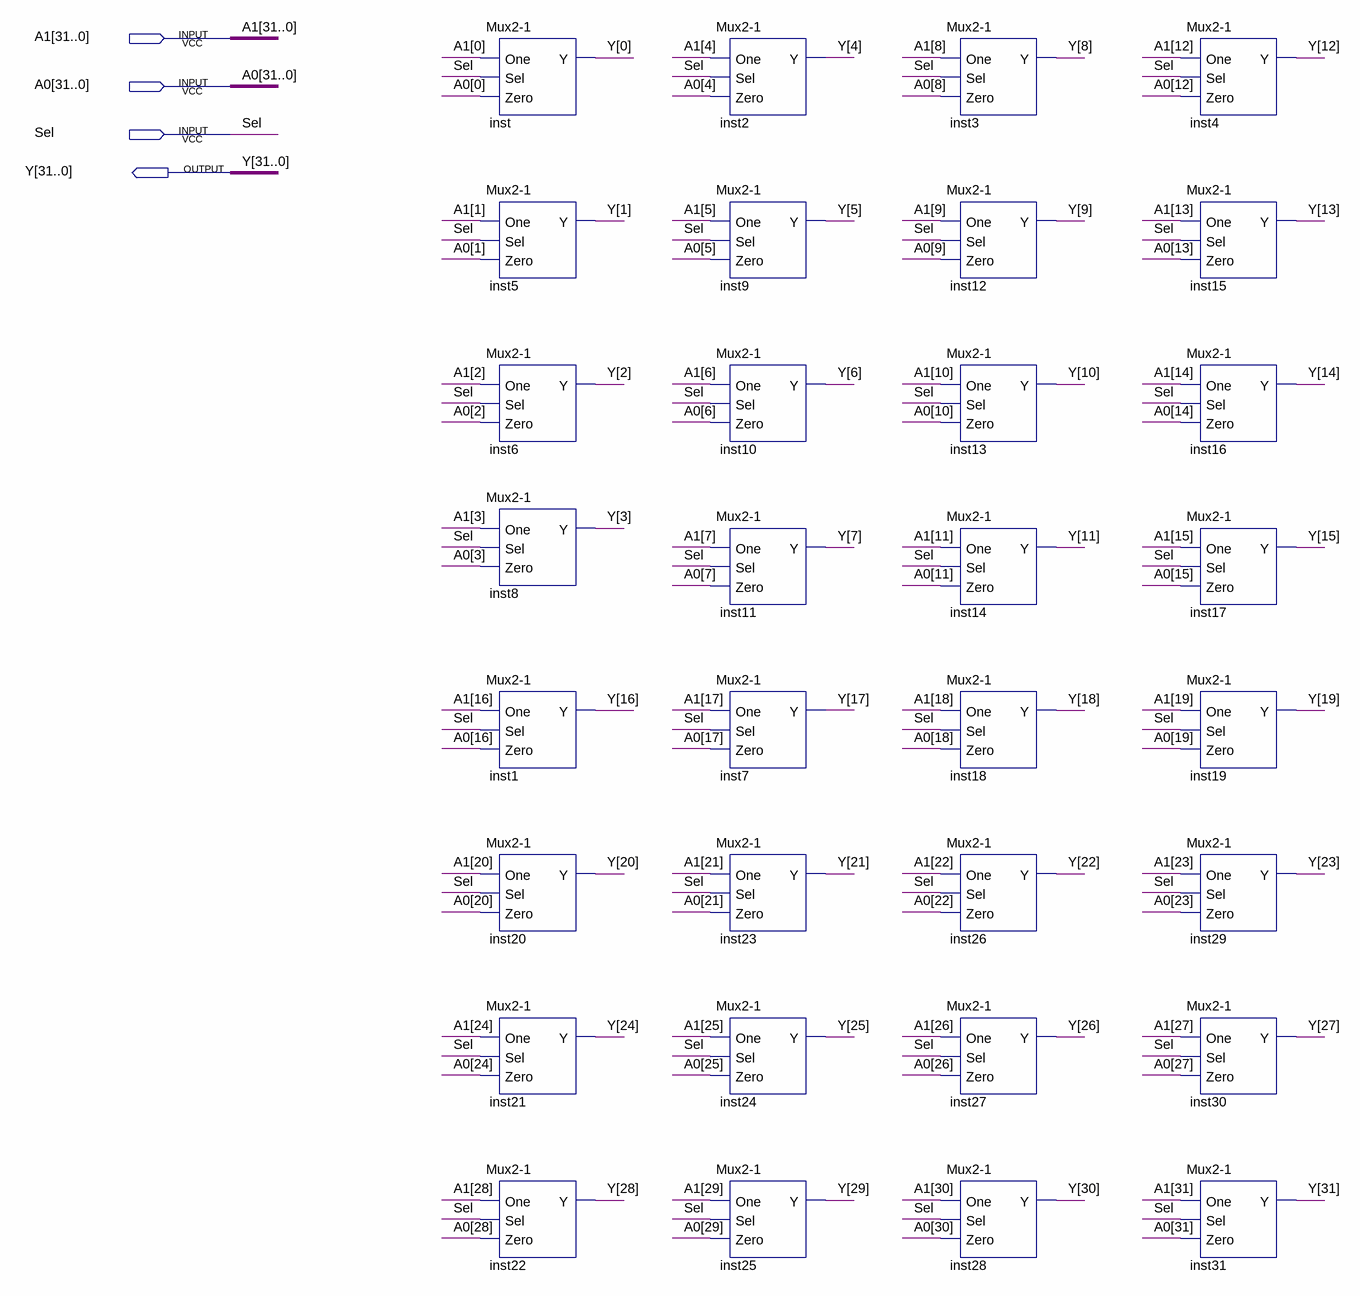
[diagram p0: schematic sheet]
// Quartus schematic Mux2-1-32bits.bdf as structural Verilog: 32 symbols, 4 pins
module \Mux2-1-32bits  (
  input  [31:0] A1,
  input  [31:0] A0,
  input  Sel,
  output [31:0] Y
);

  \Mux2-1  inst (.One(A1[0]), .Sel(Sel), .Zero(A0[0]), .Y(Y[0]));
  \Mux2-1  inst5 (.One(A1[1]), .Sel(Sel), .Zero(A0[1]), .Y(Y[1]));
  \Mux2-1  inst6 (.One(A1[2]), .Sel(Sel), .Zero(A0[2]), .Y(Y[2]));
  \Mux2-1  inst8 (.One(A1[3]), .Sel(Sel), .Zero(A0[3]), .Y(Y[3]));
  \Mux2-1  inst1 (.One(A1[16]), .Sel(Sel), .Zero(A0[16]), .Y(Y[16]));
  \Mux2-1  inst20 (.One(A1[20]), .Sel(Sel), .Zero(A0[20]), .Y(Y[20]));
  \Mux2-1  inst21 (.One(A1[24]), .Sel(Sel), .Zero(A0[24]), .Y(Y[24]));
  \Mux2-1  inst22 (.One(A1[28]), .Sel(Sel), .Zero(A0[28]), .Y(Y[28]));
  \Mux2-1  inst2 (.One(A1[4]), .Sel(Sel), .Zero(A0[4]), .Y(Y[4]));
  \Mux2-1  inst9 (.One(A1[5]), .Sel(Sel), .Zero(A0[5]), .Y(Y[5]));
  \Mux2-1  inst10 (.One(A1[6]), .Sel(Sel), .Zero(A0[6]), .Y(Y[6]));
  \Mux2-1  inst11 (.One(A1[7]), .Sel(Sel), .Zero(A0[7]), .Y(Y[7]));
  \Mux2-1  inst7 (.One(A1[17]), .Sel(Sel), .Zero(A0[17]), .Y(Y[17]));
  \Mux2-1  inst23 (.One(A1[21]), .Sel(Sel), .Zero(A0[21]), .Y(Y[21]));
  \Mux2-1  inst24 (.One(A1[25]), .Sel(Sel), .Zero(A0[25]), .Y(Y[25]));
  \Mux2-1  inst25 (.One(A1[29]), .Sel(Sel), .Zero(A0[29]), .Y(Y[29]));
  \Mux2-1  inst3 (.One(A1[8]), .Sel(Sel), .Zero(A0[8]), .Y(Y[8]));
  \Mux2-1  inst12 (.One(A1[9]), .Sel(Sel), .Zero(A0[9]), .Y(Y[9]));
  \Mux2-1  inst13 (.One(A1[10]), .Sel(Sel), .Zero(A0[10]), .Y(Y[10]));
  \Mux2-1  inst14 (.One(A1[11]), .Sel(Sel), .Zero(A0[11]), .Y(Y[11]));
  \Mux2-1  inst18 (.One(A1[18]), .Sel(Sel), .Zero(A0[18]), .Y(Y[18]));
  \Mux2-1  inst26 (.One(A1[22]), .Sel(Sel), .Zero(A0[22]), .Y(Y[22]));
  \Mux2-1  inst27 (.One(A1[26]), .Sel(Sel), .Zero(A0[26]), .Y(Y[26]));
  \Mux2-1  inst28 (.One(A1[30]), .Sel(Sel), .Zero(A0[30]), .Y(Y[30]));
  \Mux2-1  inst4 (.One(A1[12]), .Sel(Sel), .Zero(A0[12]), .Y(Y[12]));
  \Mux2-1  inst15 (.One(A1[13]), .Sel(Sel), .Zero(A0[13]), .Y(Y[13]));
  \Mux2-1  inst16 (.One(A1[14]), .Sel(Sel), .Zero(A0[14]), .Y(Y[14]));
  \Mux2-1  inst17 (.One(A1[15]), .Sel(Sel), .Zero(A0[15]), .Y(Y[15]));
  \Mux2-1  inst19 (.One(A1[19]), .Sel(Sel), .Zero(A0[19]), .Y(Y[19]));
  \Mux2-1  inst29 (.One(A1[23]), .Sel(Sel), .Zero(A0[23]), .Y(Y[23]));
  \Mux2-1  inst30 (.One(A1[27]), .Sel(Sel), .Zero(A0[27]), .Y(Y[27]));
  \Mux2-1  inst31 (.One(A1[31]), .Sel(Sel), .Zero(A0[31]), .Y(Y[31]));
endmodule
